# EAGLE board ADC2 (EAGLE 9.6.2), part 1 of 2
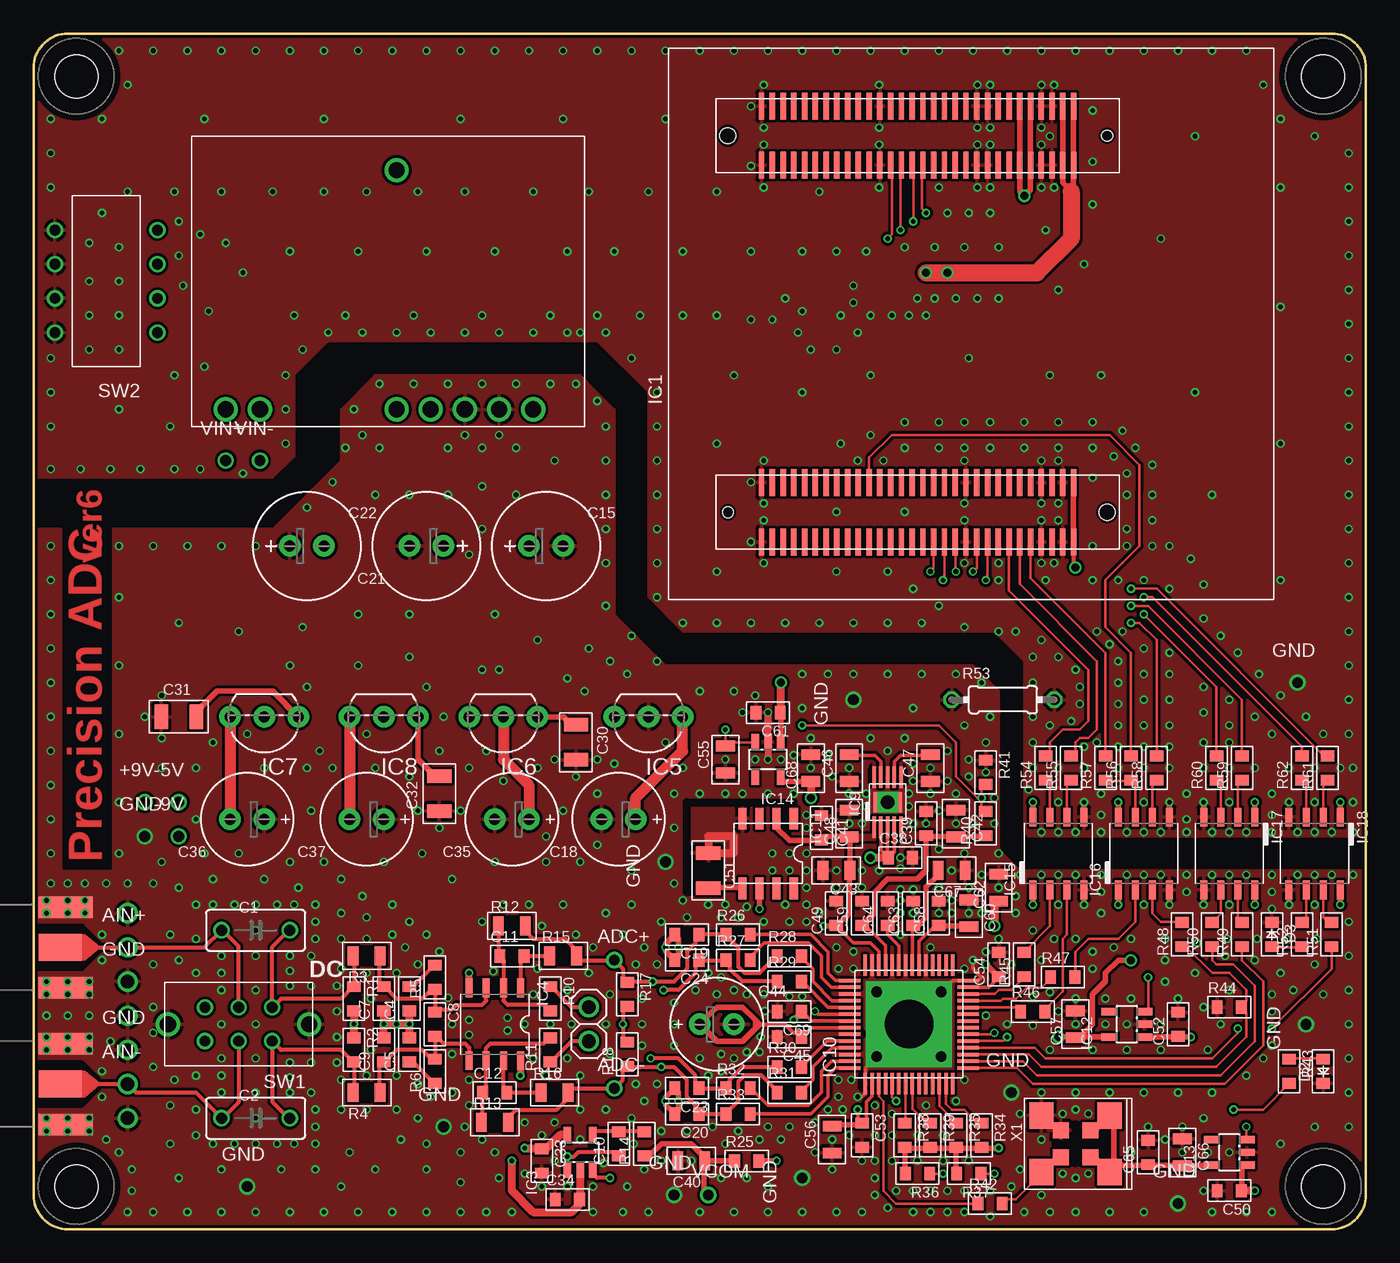
[diagram p2: board, top side]
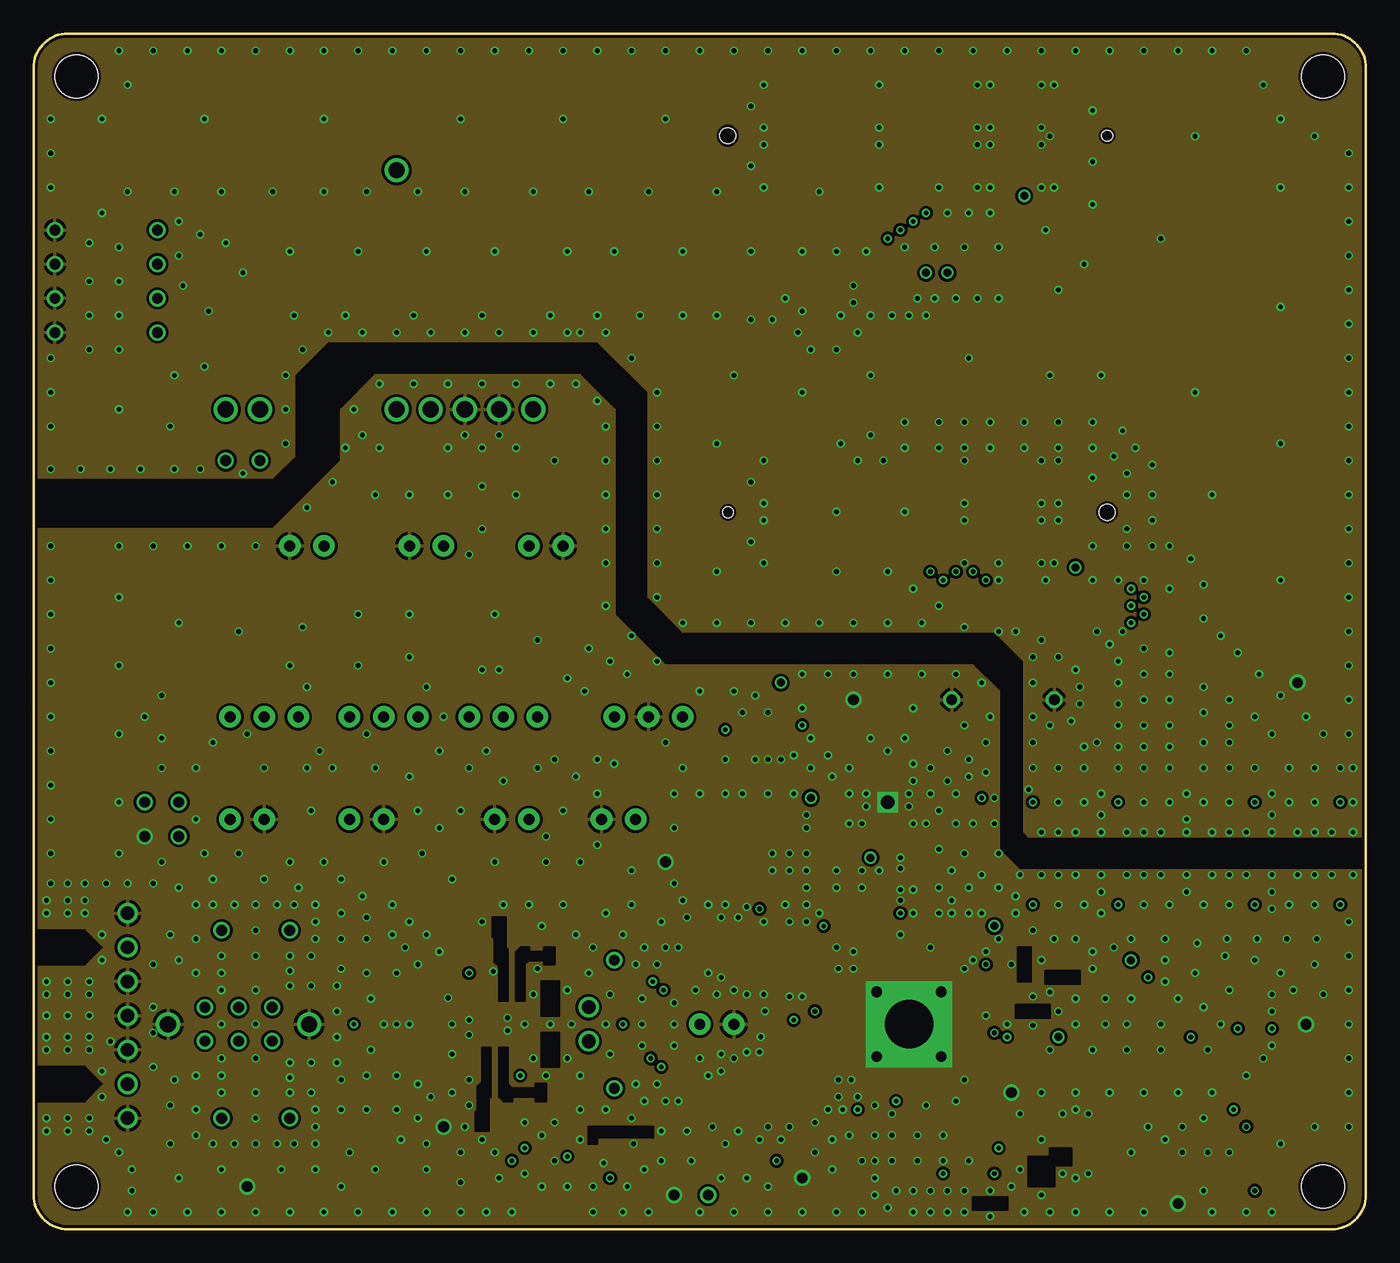
[diagram p3: board, inner layer Route2]
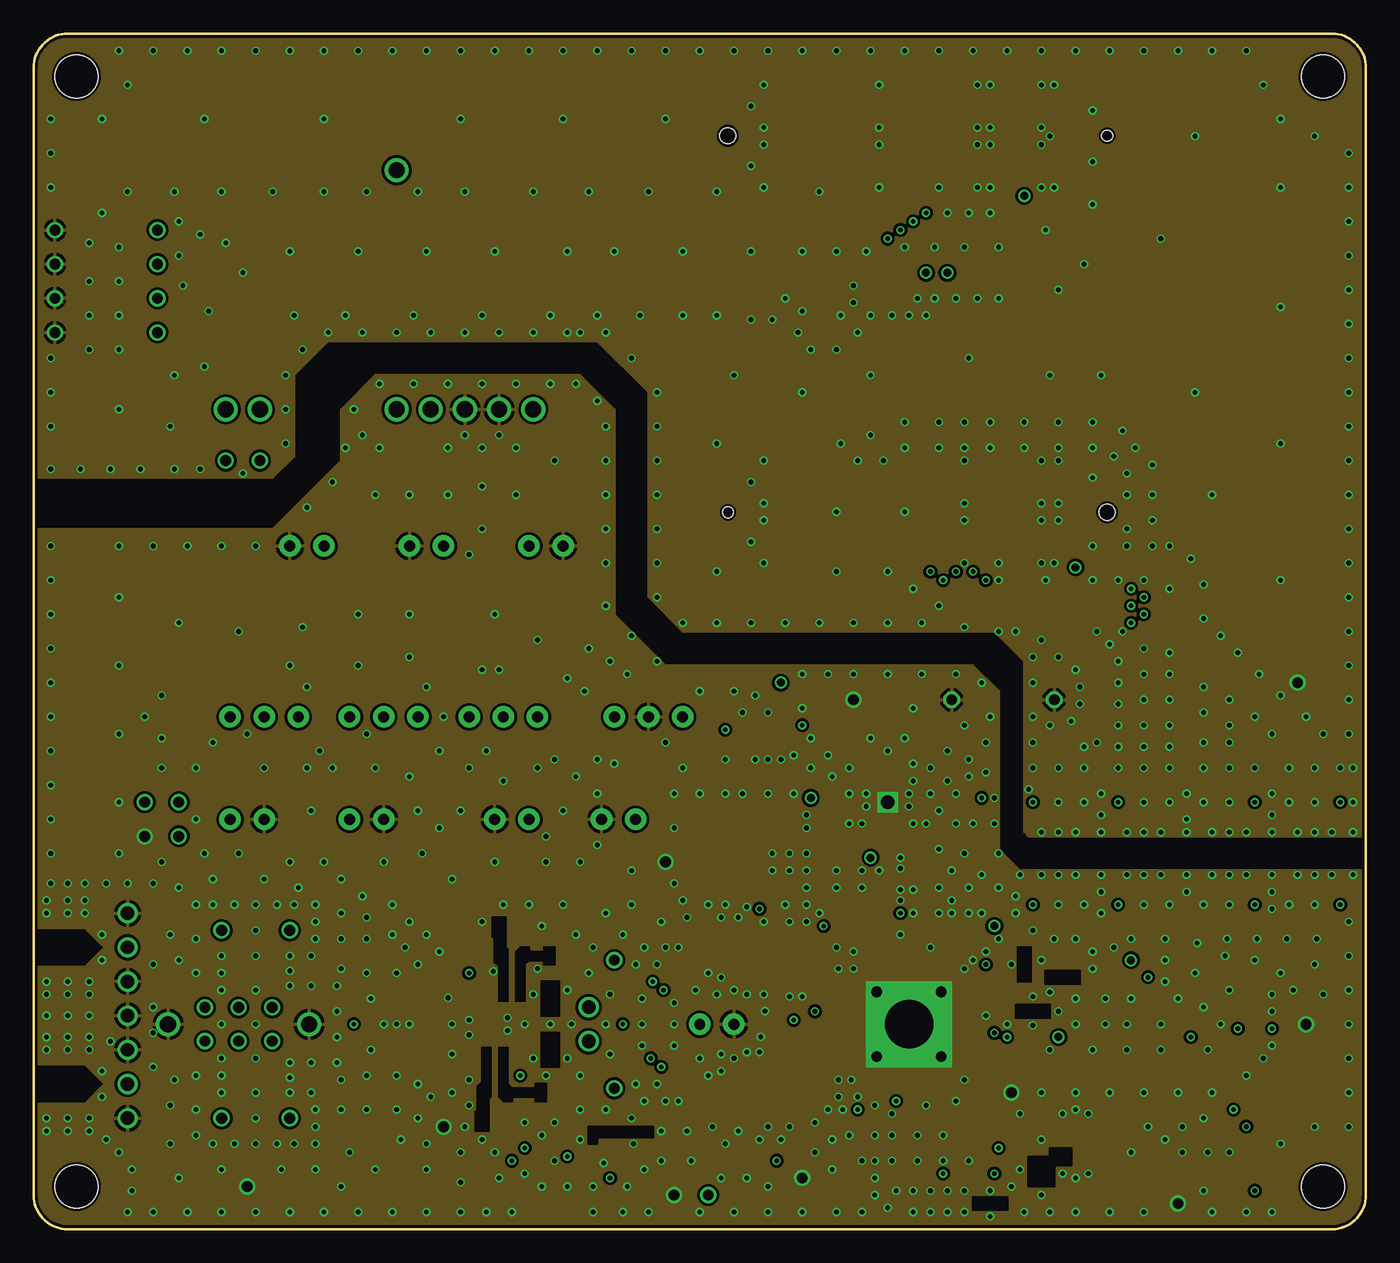
[diagram p4: board, inner layer Route3]
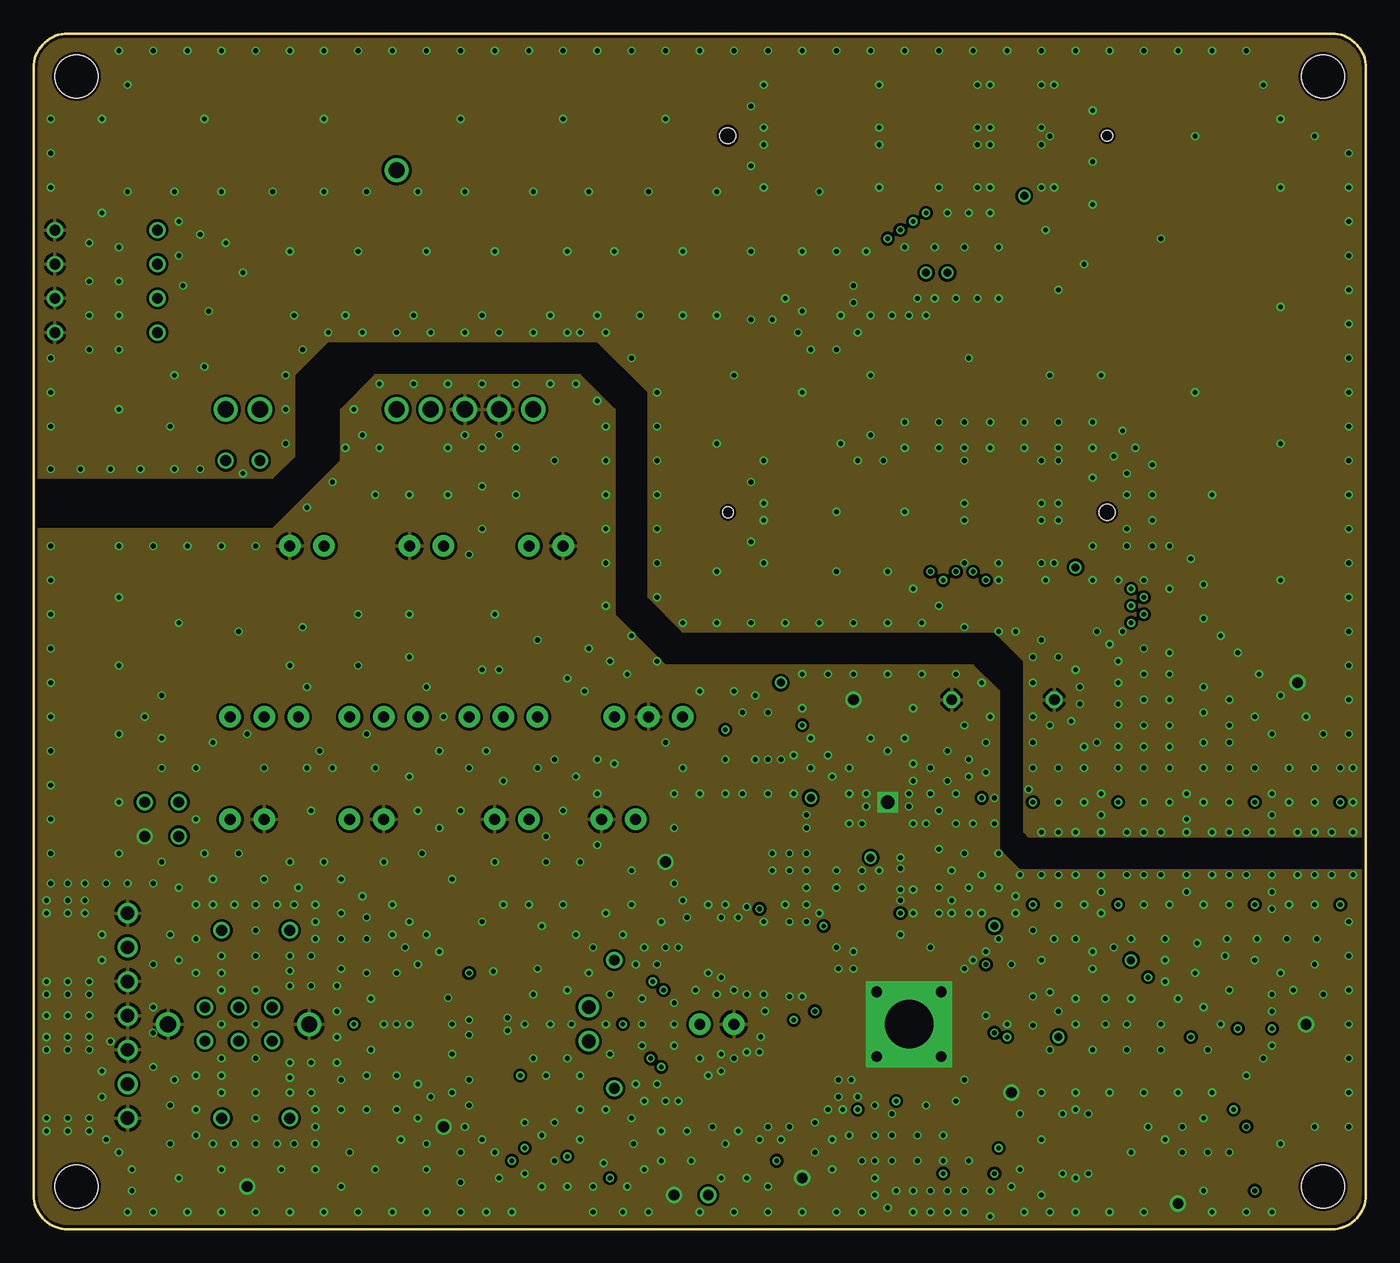
[diagram p5: board, inner layer Route14]
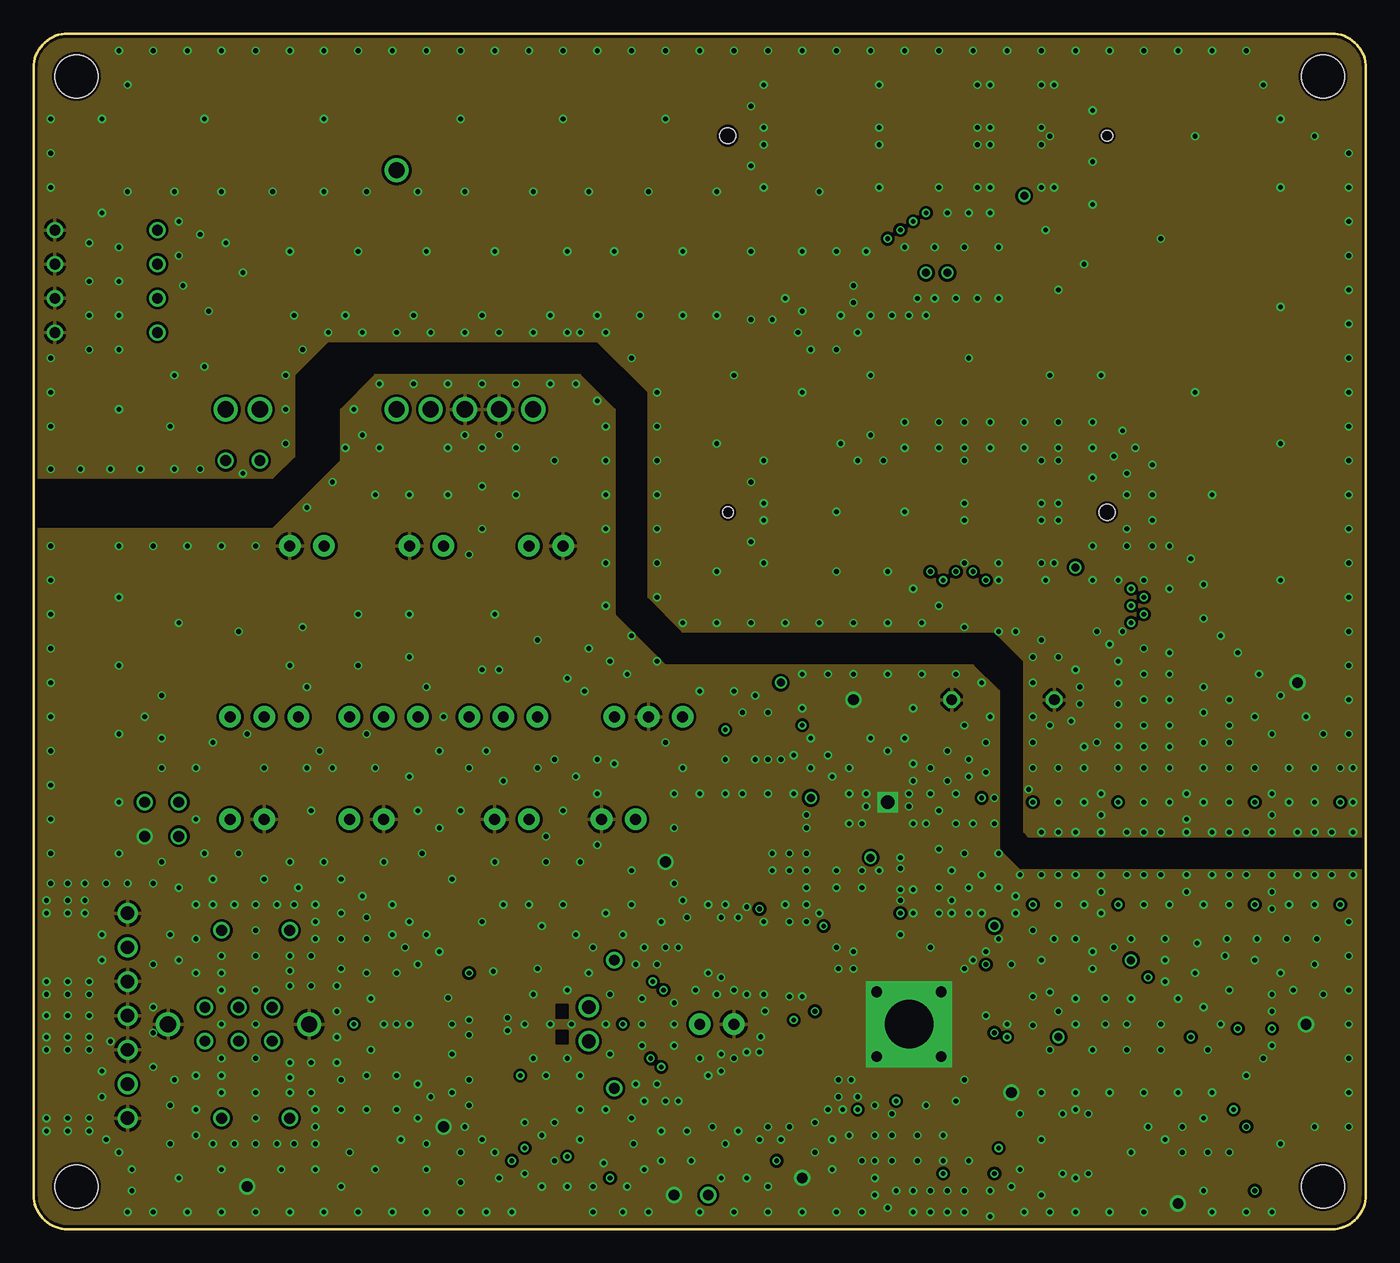
[diagram p6: board, inner layer Route15]
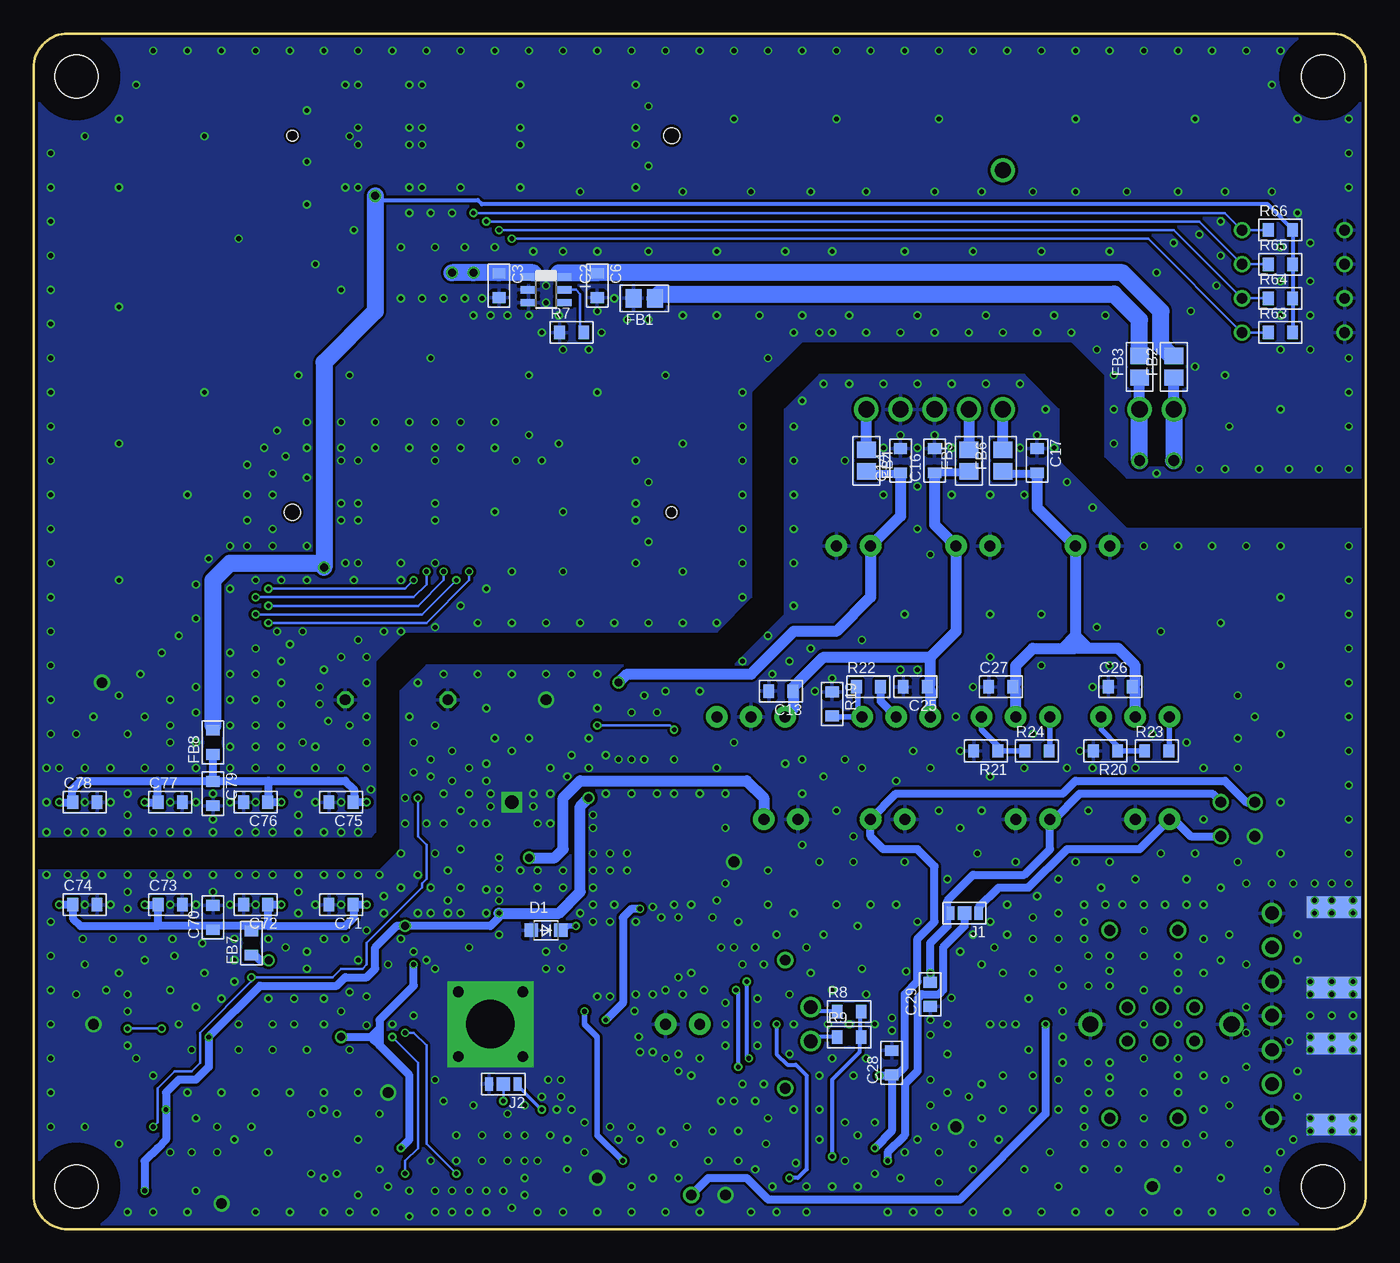
[diagram p7: board, bottom side, seen from below]

Size 99.06 x 88.9 mm. Coordinates in mm from the lower left corner, seen from the top.
Outline: 0,2.54 0,86.36 arc-90 2.54,88.9 96.52,88.9 arc-90 99.06,86.36 99.06,2.54 arc-90 96.52,0 2.54,0 arc-90 0,2.54
Copper layers (1+2*3+14*15+16): Top 0.035mm / dielectric 0.2mm / Route2 0.0175mm / dielectric 1.065mm / Route3 0.035mm / dielectric 0.2mm / Route14 0.035mm / dielectric 0.15mm / Route15 0.0175mm / dielectric 0.2mm / Bottom 0.035mm
Design rules "JLCPCB_6layer_limit *": minimum track width 5mil, minimum drill 0.3mm, track to track 5mil, track to pad 5mil, pad to pad 5mil, via to via 5mil, smd to smd 0mil, copper to edge 0.2mm, drill to drill 10mil, minimum pad ring 0.13mm, minimum via ring 0.13mm, stop-mask expansion 2mil, vias tented up to drill 1mm, thermal gap 10mil
tRestrict: 11 lines

## Footprints (pad centres in the part's own frame; a part is rotated, then mirrored left to right if it is on the bottom)
C050 = drill 0.813: 1 -2.54,0; 2 2.54,0
1608C = smd 0.8 x 1: 1 -0.9,0; 2 0.9,0
1608-3 = smd 0.8 x 1: 1 -0.9,0; 2 0.9,0
E2,5-8 = drill 0.813 pad 1.6: + -1.27,0; - 1.27,0
E2.5-6.5 = drill 0.813 pad 1.6: + -1.27,0; - 1.27,0
3216 = smd 1 x 1.8: 1 -1.3,0; 2 1.3,0
2012 = smd 0.8 x 1.4: 1 -1,0; 2 1,0
SMA-EDGE = smd 1.6 x 4: G1 -3,0; G2 3,0 | smd 1.6 x 4 bottom: G3 -3,0; G4 3,0 | smd 2 x 3.2: SIG 0,0.4
SOD323 = smd 1 x 1: 1 -1.1,0; 2 1.1,0
D1608 = smd 0.8 x 1: A 0.9,0; K -0.9,0
HOLE_3.2 = hole 3.2: 0,0
2012-J = smd 1.2 x 1.4: 1 -0.8,0; 2 0.8,0
1608-FB = smd 0.8 x 1: 1 -0.9,0; 2 0.9,0
FPGA_CORE_BOARD = smd 0.4 x 2: 1 -11.6,-11.8; 2 -11.6,-16.2; 3 -10.8,-11.8; 4 -10.8,-16.2; 5 -10,-11.8; 6 -10,-16.2; 7 -9.2,-11.8; 8 -9.2,-16.2; 9 -8.4,-11.8; 10 -8.4,-16.2; 11 -7.6,-11.8; 12 -7.6,-16.2; 13 -6.8,-11.8; 14 -6.8,-16.2; 15 -6,-11.8; 16 -6,-16.2; 17 -5.2,-11.8; 18 -5.2,-16.2; 19 -4.4,-11.8; 20 -4.4,-16.2; 21 -3.6,-11.8; 22 -3.6,-16.2; 23 -2.8,-11.8; 24 -2.8,-16.2; 25 -2,-11.8; 26 -2,-16.2; 27 -1.2,-11.8; 28 -1.2,-16.2; 29 -0.4,-11.8; 30 -0.4,-16.2; 31 0.4,-11.8; 32 0.4,-16.2; 33 1.2,-11.8; 34 1.2,-16.2; 35 2,-11.8; 36 2,-16.2; 37 2.8,-11.8; 38 2.8,-16.2; 39 3.6,-11.8; 40 3.6,-16.2; 41 4.4,-11.8; 42 4.4,-16.2; 43 5.2,-11.8; 44 5.2,-16.2; 45 6,-11.8; 46 6,-16.2; 47 6.8,-11.8; 48 6.8,-16.2; 49 7.6,-11.8; 50 7.6,-16.2; 51 8.4,-11.8; 52 8.4,-16.2; 53 9.2,-11.8; 54 9.2,-16.2; 55 10,-11.8; 56 10,-16.2; 57 10.8,-11.8; 58 10.8,-16.2; 59 11.6,-11.8; 60 11.6,-16.2; 61 -11.6,16.2; 62 -11.6,11.8; 63 -10.8,16.2; 64 -10.8,11.8; 65 -10,16.2; 66 -10,11.8; 67 -9.2,16.2; 68 -9.2,11.8; 69 -8.4,16.2; 70 -8.4,11.8; 71 -7.6,16.2; 72 -7.6,11.8; 73 -6.8,16.2; 74 -6.8,11.8; 75 -6,16.2; 76 -6,11.8; 77 -5.2,16.2; 78 -5.2,11.8; 79 -4.4,16.2; 80 -4.4,11.8; 81 -3.6,16.2; 82 -3.6,11.8; 83 -2.8,16.2; 84 -2.8,11.8; 85 -2,16.2; 86 -2,11.8; 87 -1.2,16.2; 88 -1.2,11.8; 89 -0.4,16.2; 90 -0.4,11.8; 91 0.4,16.2; 92 0.4,11.8; 93 1.2,16.2; 94 1.2,11.8; 95 2,16.2; 96 2,11.8; 97 2.8,16.2; 98 2.8,11.8; 99 3.6,16.2; 100 3.6,11.8; 101 4.4,16.2; 102 4.4,11.8; 103 5.2,16.2; 104 5.2,11.8; 105 6,16.2; 106 6,11.8; 107 6.8,16.2; 108 6.8,11.8; 109 7.6,16.2; 110 7.6,11.8; 111 8.4,16.2; 112 8.4,11.8; 113 9.2,16.2; 114 9.2,11.8; 115 10,16.2; 116 10,11.8; 117 10.8,16.2; 118 10.8,11.8; 119 11.6,16.2; 120 11.6,11.8 | hole 0.8: 14.1,14; -14.1,-14 | hole 1.2: -14.1,14; 14.1,-14
SOT23-6 = smd 0.55 x 1.2: 1 -0.95,-1.3; 2 0,-1.3; 3 0.95,-1.3; 4 0.95,1.3; 5 0,1.3; 6 -0.95,1.3
SOT23-5 = smd 0.55 x 1.2: 1 -0.95,-1.3; 2 0,-1.3; 3 0.95,-1.3; 4 0.95,1.3; 5 -0.95,1.3
SOP8-3 = smd 0.52 x 1.4: 1 -1.905,-2.7; 2 -0.635,-2.7; 3 0.635,-2.7; 4 1.905,-2.7; 5 1.905,2.7; 6 0.635,2.7; 7 -0.635,2.7; 8 -1.905,2.7
TO-92 = drill 0.813 pad 1.6: 1 -2.54,0; 2 0,0; 3 2.54,0
PLP10 = smd 0.26 x 1.6: 1 -1,-1.85; 2 -0.5,-1.85; 3 0,-1.85; 4 0.5,-1.85; 5 1,-1.85; 6 1,1.85; 7 0.5,1.85; 8 0,1.85; 9 -0.5,1.85; 10 -1,1.85 | drill 1 pad 1.5 square: HT 0,0 | smd 2.1 x 1.5: HT2 0,0
QFN56-HT-HOLE = smd 0.26 x 1.6: 1 -3.25,-4.4; 2 -2.75,-4.4; 3 -2.25,-4.4; 4 -1.75,-4.4; 5 -1.25,-4.4; 6 -0.75,-4.4; 7 -0.25,-4.4; 8 0.25,-4.4; 9 0.75,-4.4; 10 1.25,-4.4; 11 1.75,-4.4; 12 2.25,-4.4; 13 2.75,-4.4; 14 3.25,-4.4; 29 3.25,4.4; 30 2.75,4.4; 31 2.25,4.4; 32 1.75,4.4; 33 1.25,4.4; 34 0.75,4.4; 35 0.25,4.4; 36 -0.25,4.4; 37 -0.75,4.4; 38 -1.25,4.4; 39 -1.75,4.4; 40 -2.25,4.4; 41 -2.75,4.4; 42 -3.25,4.4 | smd 1.6 x 0.26: 15 4.4,-3.25; 16 4.4,-2.75; 17 4.4,-2.25; 18 4.4,-1.75; 19 4.4,-1.25; 20 4.4,-0.75; 21 4.4,-0.25; 22 4.4,0.25; 23 4.4,0.75; 24 4.4,1.25; 25 4.4,1.75; 26 4.4,2.25; 27 4.4,2.75; 28 4.4,3.25; 43 -4.4,3.25; 44 -4.4,2.75; 45 -4.4,2.25; 46 -4.4,1.75; 47 -4.4,1.25; 48 -4.4,0.75; 49 -4.4,0.25; 50 -4.4,-0.25; 51 -4.4,-0.75; 52 -4.4,-1.25; 53 -4.4,-1.75; 54 -4.4,-2.25; 55 -4.4,-2.75; 56 -4.4,-3.25 | drill 3.6 pad 6.4 square: HT 0,0 | drill 0.8 pad 1.6 square: HT1 -2.4,2.4; HT2 -2.4,-2.4; HT3 2.4,-2.4; HT4 2.4,2.4
SOP8 = smd 0.6 x 1.6: 1 -1.905,-2.6; 2 -0.635,-2.6; 3 0.635,-2.6; 4 1.905,-2.6; 5 1.905,2.6; 6 0.635,2.6; 7 -0.635,2.6; 8 -1.905,2.6
SOP8-2 = smd 0.52 x 1.4: 1 -1.905,-2.7; 2 -0.635,-2.7; 3 0.635,-2.7; 4 1.905,-2.7; 5 1.905,2.7; 6 0.635,2.7; 7 -0.635,2.7; 8 -1.905,2.7
1608-3-J = smd 0.6 x 1: 1 -1.05,0; 3 1.05,0 | smd 1 x 1: 2 0,0
1X02 = drill 1.016: 1 -1.27,0; 2 1.27,0
2012-R = smd 0.8 x 1.4: 1 -1,0; 2 1,0
1608 = smd 0.8 x 1: 1 -0.9,0; 2 0.9,0
0204/7 = drill 0.813 octagon: 1 -3.81,0; 2 3.81,0
SS22E01G5 = drill 0.8: A1 -2.5,1.25; A2 -2.5,-1.25; B1 2.5,1.25; B2 2.5,-1.25; C1 0,1.25; C2 0,-1.25 | drill 1.2: HT1 -5.25,0; HT2 5.25,0
DIPSW-4 = drill 0.8: 1 -3.81,-3.81; 2 -1.27,-3.81; 3 1.27,-3.81; 4 3.81,-3.81; 5 3.81,3.81; 6 1.27,3.81; 7 -1.27,3.81; 8 -3.81,3.81
TESTPIN-MID = drill 1 pad 1.4: 1 0,0
TESTPIN = drill 0.8: 1 0,0
DCDC = drill 1.2: +5V 10.16,0; GND1 5.08,0; GND2 7.62,0; NC 0,17.78; V+ 2.54,0; V- 0,0; VIN+ -12.7,0; VIN- -10.16,0
KC7050 = smd 1.8 x 2: 1 -2.54,-2.1; 2 2.54,-2.1; 3 2.54,2.1; 4 -2.54,2.1 | smd 1.2 x 1.2: 1-2 -1.1,-1; 2-2 1.1,-1; 3-2 1.1,1; 4-2 -1.1,1

## Placement (x,y rotation side)
C1  1.5u  [C050]  16.51,22.23 0 top
C2  1.5u  [C050]  16.51,8.26 0 top
C3  1u  [1608C]  64.45,70.17 270 bottom
C4  22p  [1608C]  27.94,17.14 90 top
C5  22p  [1608C]  27.94,13.34 90 top
C6  1u  [1608C]  57.15,70.17 270 bottom
C7  DNP  [1608C]  26.04,17.14 90 top
C8  DNP  [1608-3]  29.84,15.24 270 top
C9  DNP  [1608C]  26.04,13.34 90 top
C10  68p  [1608-3]  43.5,6.35 90 top
C11  100p  [1608C]  35.56,20.32 0 top
C12  100p  [1608C]  34.29,10.16 0 top
C13  0.1u  [1608C]  43.5,40.01 180 bottom
C14  1u  [1608C]  34.61,57.15 90 bottom
C15  100u  [E2,5-8]  38.1,50.8 0 top
C16  1u  [1608C]  32.07,57.15 90 bottom
C17  1u  [1608C]  24.45,57.15 270 bottom
C18  100u  [E2.5-6.5]  43.5,30.48 180 top
C19  100p  [1608-3]  48.58,21.91 180 top
C20  100p  [1608-3]  48.58,8.57 180 top
C21  100u  [E2,5-8]  29.21,50.8 180 top
C22  100u  [E2,5-8]  20.32,50.8 0 top
C23  100p  [1608C]  48.58,10.48 180 top
C24  100p  [1608C]  48.58,20 180 top
C25  0.1u  [1608C]  33.5,40.32 180 bottom
C26  0.1u  [1608C]  18.26,40.32 0 bottom
C27  0.1u  [1608C]  27.15,40.32 0 bottom
C28  0.1u  [1608C]  35.24,12.38 90 bottom
C29  0.1u  [1608C]  32.38,17.46 90 bottom
C30  10u  [3216]  40.32,36.2 270 top
C31  10u  [3216]  10.79,38.1 0 top
C32  10u  [3216]  30.16,32.38 90 top
C33  0.1u  [1608C]  37.78,5.08 270 top
C34  0.1u  [1608C]  39.69,2.22 0 top
C35  100u  [E2.5-6.5]  35.56,30.48 180 top
C36  100u  [E2.5-6.5]  15.88,30.48 180 top
C37  100u  [E2.5-6.5]  24.77,30.48 180 top
C38  1u  [1608C]  64.45,27.62 0 top
C39  1u  [1608C]  66.36,30.16 90 top
C40  10u  [2012]  48.9,5.08 0 top
C41  1u  [1608C]  58.58,29.84 90 top
C42  10u  [2012]  68.58,30.16 90 top
C43  10u  [2012]  59.69,26.67 180 top
C44  330u  [E2.5-6.5]  50.8,15.24 0 top
C45  0.1u  [1608C]  56.2,14.29 180 top
C46  10u  [2012]  60.64,34.29 270 top
C47  10u  [2012]  66.67,34.29 270 top
C48  10u  [2012]  60.64,30.16 90 top
C49  0.1u  [1608C]  59.69,23.5 90 top
C50  0.1u  [1608C]  88.9,2.86 180 top
C51  10u  [3216]  50.16,26.67 90 top
C52  0.1u  [1608C]  85.09,15.24 90 top
C53  0.1u  [1608C]  61.59,6.99 270 top
C54  0.1u  [1608C]  71.75,19.68 90 top
C55  10u  [2012]  51.44,34.92 270 top
C56  2.2u  [2012]  59.37,6.67 270 top
C57  10u  [2012]  77.47,15.24 90 top
C58  0.1u  [1608C]  67.31,23.5 90 top
C59  0.1u  [1608C]  61.59,23.5 90 top
C60  10u  [2012]  69.53,23.5 90 top
C61  0.1u  [1608C]  54.61,38.42 180 top
C62  10u  [2012]  71.75,25.4 90 top
C63  0.1u  [1608C]  65.41,23.5 90 top
C64  0.1u  [1608C]  63.5,23.5 90 top
C65  0.1u  [1608C]  82.87,5.71 90 top
C66  10u  [2012]  85.41,5.71 90 top
C67  10u  [2012]  68.26,26.67 0 top
C68  10u  [2012]  57.78,34.29 90 top
C69  1u  [1608C]  56.2,16.19 180 top
C70  10u  [1608C]  85.72,23.18 90 bottom
C71  0.1u  [1608C]  76.2,24.13 180 bottom
C72  0.1u  [1608C]  82.55,24.13 180 bottom
C73  0.1u  [1608C]  88.9,24.13 0 bottom
C74  0.1u  [1608C]  95.25,24.13 0 bottom
C75  0.1u  [1608C]  76.2,31.75 180 bottom
C76  0.1u  [1608C]  82.55,31.75 180 bottom
C77  0.1u  [1608C]  88.9,31.75 0 bottom
C78  0.1u  [1608C]  95.25,31.75 0 bottom
C79  10u  [1608C]  85.72,32.38 270 bottom
CON1  IN-  [SMA-EDGE]  2.38,20.95 90 top
CON2  IN+  [SMA-EDGE]  2.38,10.79 90 top
D1  TVS  [SOD323]  60.96,22.23 0 bottom
D2  PWR  [D1608]  95.89,11.75 90 top
D3  CLIP  [D1608]  92.08,21.91 270 top
DR1  HOLE-3.2  [HOLE_3.2]  3.17,3.17 0 top
DR2  HOLE-3.2  [HOLE_3.2]  95.89,3.17 0 top
DR3  HOLE-3.2  [HOLE_3.2]  3.17,85.72 0 top
DR4  HOLE-3.2  [HOLE_3.2]  95.89,85.72 0 top
FB1  FB  [2012-J]  53.66,69.22 0 bottom
FB2  FB  [2012-J]  14.29,64.14 270 bottom
FB3  FB  [2012-J]  16.83,64.14 270 bottom
FB4  FB  [2012-J]  37.15,57.15 90 bottom
FB5  FB  [2012-J]  29.53,57.15 270 bottom
FB6  FB  [2012-J]  26.99,57.15 270 bottom
FB7  FB  [1608-FB]  82.87,21.27 90 bottom
FB8  FB  [1608-FB]  85.72,36.2 90 bottom
IC1  FPGA CORE BOARD  [FPGA_CORE_BOARD]  65.72,67.31 0 top
IC2  AP22652  [SOT23-6]  60.96,69.85 270 bottom
IC3  OPA  [SOT23-5]  40.64,5.71 0 top
IC4  OPA  [SOP8-3]  34.29,15.24 180 top
IC5  7808  [TO-92]  45.72,38.1 180 top
IC6  LM317-L  [TO-92]  34.92,38.1 180 top
IC7  LM337-L  [TO-92]  17.14,38.1 180 top
IC8  LM337-L  [TO-92]  26.04,38.1 180 top
IC9  AK1110  [PLP10]  63.5,31.75 0 top
IC10  AD4134  [QFN56-HT-HOLE]  65.09,15.24 90 top
IC11  REF5040  [SOP8]  54.61,27.94 180 top
IC12  1.8V  [SOT23-5]  81.28,15.24 90 top
IC13  1.8V  [SOT23-5]  88.9,5.71 90 top
IC14  2.7V  [SOT23-5]  54.61,34.92 180 top
IC15  SI8620  [SOP8-2]  76.2,27.94 0 top
IC16  SI8620  [SOP8-2]  82.55,27.94 0 top
IC17  SI8620  [SOP8-2]  88.9,27.94 180 top
IC18  SI8620  [SOP8-2]  95.25,27.94 180 top
J1  V-SEL  [1608-3-J]  29.84,23.5 180 bottom
J2  CLKSEL  [1608-3-J]  64.14,10.79 180 bottom
JP1  GAIN  [1X02]  41.27,15.24 270 top
R1  100k  [1608-3]  23.81,17.14 270 top
R2  100k  [1608-3]  23.81,13.34 270 top
R3  20  [2012-R]  24.77,20.32 0 top
R4  20  [2012-R]  24.77,10.16 0 top
R5  50  [1608-3]  29.84,18.73 90 top
R6  50  [1608-3]  29.84,11.75 90 top
R7  10k  [1608]  59.05,66.67 0 bottom
R8  1k  [1608-3]  38.42,16.19 0 bottom
R9  1k  [1608-3]  38.42,14.29 0 bottom
R10  24  [1608-3]  38.42,17.14 270 top
R11  24  [1608-3]  38.42,13.34 90 top
R12  510  [2012-R]  35.56,22.54 0 top
R13  510  [2012-R]  34.29,7.94 0 top
R14  1k  [1608]  45.4,6.35 90 top
R15  270  [2012-R]  39.37,20.32 0 top
R16  270  [2012-R]  38.73,10.16 0 top
R17  3.6k  [1608]  44.13,17.46 270 top
R18  3.6k  [1608]  44.13,13.02 90 top
R19  680  [1608]  39.69,39.05 270 bottom
R20  680  [1608]  19.37,35.56 180 bottom
R21  330  [1608]  28.26,35.56 180 bottom
R22  120  [1608]  36.99,40.32 0 bottom
R23  120  [1608]  15.56,35.56 0 bottom
R24  120  [1608]  24.45,35.56 0 bottom
R25  120  [1608]  53.02,5.08 0 top
R26  10  [1608-3]  52.39,21.91 0 top
R27  10  [1608]  52.39,20 0 top
R28  10  [1608-3]  56.2,20.32 0 top
R29  10  [1608-3]  56.2,18.41 0 top
R30  10  [1608-3]  56.2,12.06 0 top
R31  10  [1608-3]  56.2,10.16 0 top
R32  10  [1608]  52.39,10.48 0 top
R33  10  [1608-3]  52.39,8.57 0 top
R34  10k  [1608]  70.48,6.99 270 top
R35  10k  [1608]  68.58,6.99 270 top
R36  10k  [1608]  65.72,4.13 180 top
R37  10k  [1608]  69.53,4.13 180 top
R38  10k  [1608]  64.77,6.99 270 top
R39  10k  [1608]  66.67,6.99 270 top
R40  47k  [1608]  70.8,30.16 90 top
R41  47k  [1608]  70.8,33.97 270 top
R42  39  [1608]  71.12,1.91 0 top
R43  3.3k  [1608]  93.34,11.75 270 top
R44  10k  [1608]  88.9,16.51 0 top
R45  ODR  [1608-3]  73.66,19.68 90 top
R46  DOUT  [1608-3]  74.3,16.19 0 top
R47  DCLK  [1608]  76.52,18.73 0 top
R48  SDO  [1608]  85.41,21.91 90 top
R49  CS  [1608]  89.85,21.91 90 top
R50  SCLK  [1608]  87.63,21.91 90 top
R51  SDI  [1608]  96.52,21.91 90 top
R52  3.3k  [1608]  94.3,21.91 90 top
R53  10M  [0204/7]  72.07,39.37 0 top
R54  ODR  [1608]  75.25,34.29 90 top
R55  DOUT  [1608]  77.15,34.29 90 top
R56  SUB  [1608]  81.6,34.29 90 top
R57  DCLK  [1608]  79.69,34.29 90 top
R58  SDO  [1608]  83.5,34.29 90 top
R59  CS  [1608]  89.85,34.29 90 top
R60  SCLK  [1608]  87.95,34.29 90 top
R61  SDI  [1608]  96.2,34.29 90 top
R62  LED  [1608]  94.3,34.29 90 top
R63  10k  [1608]  6.35,66.67 0 bottom
R64  10k  [1608]  6.35,69.22 0 bottom
R65  10k  [1608]  6.35,71.75 0 bottom
R66  10k  [1608]  6.35,74.3 0 bottom
SW1  AC  [SS22E01G5]  15.24,15.24 180 top
SW2  MODE-SW  [DIPSW-4]  5.4,70.48 90 top
TP1  GND  [TESTPIN-MID]  6.99,13.34 0 top
TP2  AIN+  [TESTPIN-MID]  6.99,20.95 0 top
TP3  GND  [TESTPIN-MID]  6.99,18.41 0 top
TP4  GND  [TESTPIN]  72.71,10.16 0 top
TP5  GND  [TESTPIN]  57.15,3.81 90 top
TP6  AIN-  [TESTPIN-MID]  6.99,10.79 0 top
TP7  GND  [TESTPIN]  46.99,27.3 90 top
TP8  GND  [TESTPIN]  60.96,39.37 90 top
TP9  GND  [TESTPIN]  94.61,15.24 90 top
TP10  GND  [TESTPIN]  47.62,2.54 0 top
TP11  GND  [TESTPIN]  85.09,1.91 0 top
TP12  GND  [TESTPIN]  30.48,7.62 0 top
TP13  GND  [TESTPIN]  93.98,40.64 0 top
TP14  GND  [TESTPIN]  15.88,3.17 0 top
TP15  GND  [TESTPIN]  8.26,29.21 0 top
TP16  +9V  [TESTPIN]  8.26,31.75 0 top
TP17  -9V  [TESTPIN]  10.79,29.21 0 top
TP18  -5V  [TESTPIN]  10.79,31.75 0 top
TP19  GND  [TESTPIN-MID]  6.99,15.88 0 top
TP20  GND  [TESTPIN-MID]  6.99,23.5 0 top
TP21  GND  [TESTPIN-MID]  6.99,8.26 0 top
TP22  VCOM  [TESTPIN]  50.16,2.54 0 top
TP23  ADC+  [TESTPIN]  43.18,20 0 top
TP24  ADC-  [TESTPIN]  43.18,10.48 0 top
TP30  VIN+  [TESTPIN]  14.29,57.15 0 top
TP31  VIN-  [TESTPIN]  16.83,57.15 0 top
U1  DC-DC  [DCDC]  26.99,60.96 0 top
X1  48MHz  [KC7050]  77.47,6.35 180 top